# EAGLE schematic akabeacon_circle_ble113 (EAGLE 7.3.2)
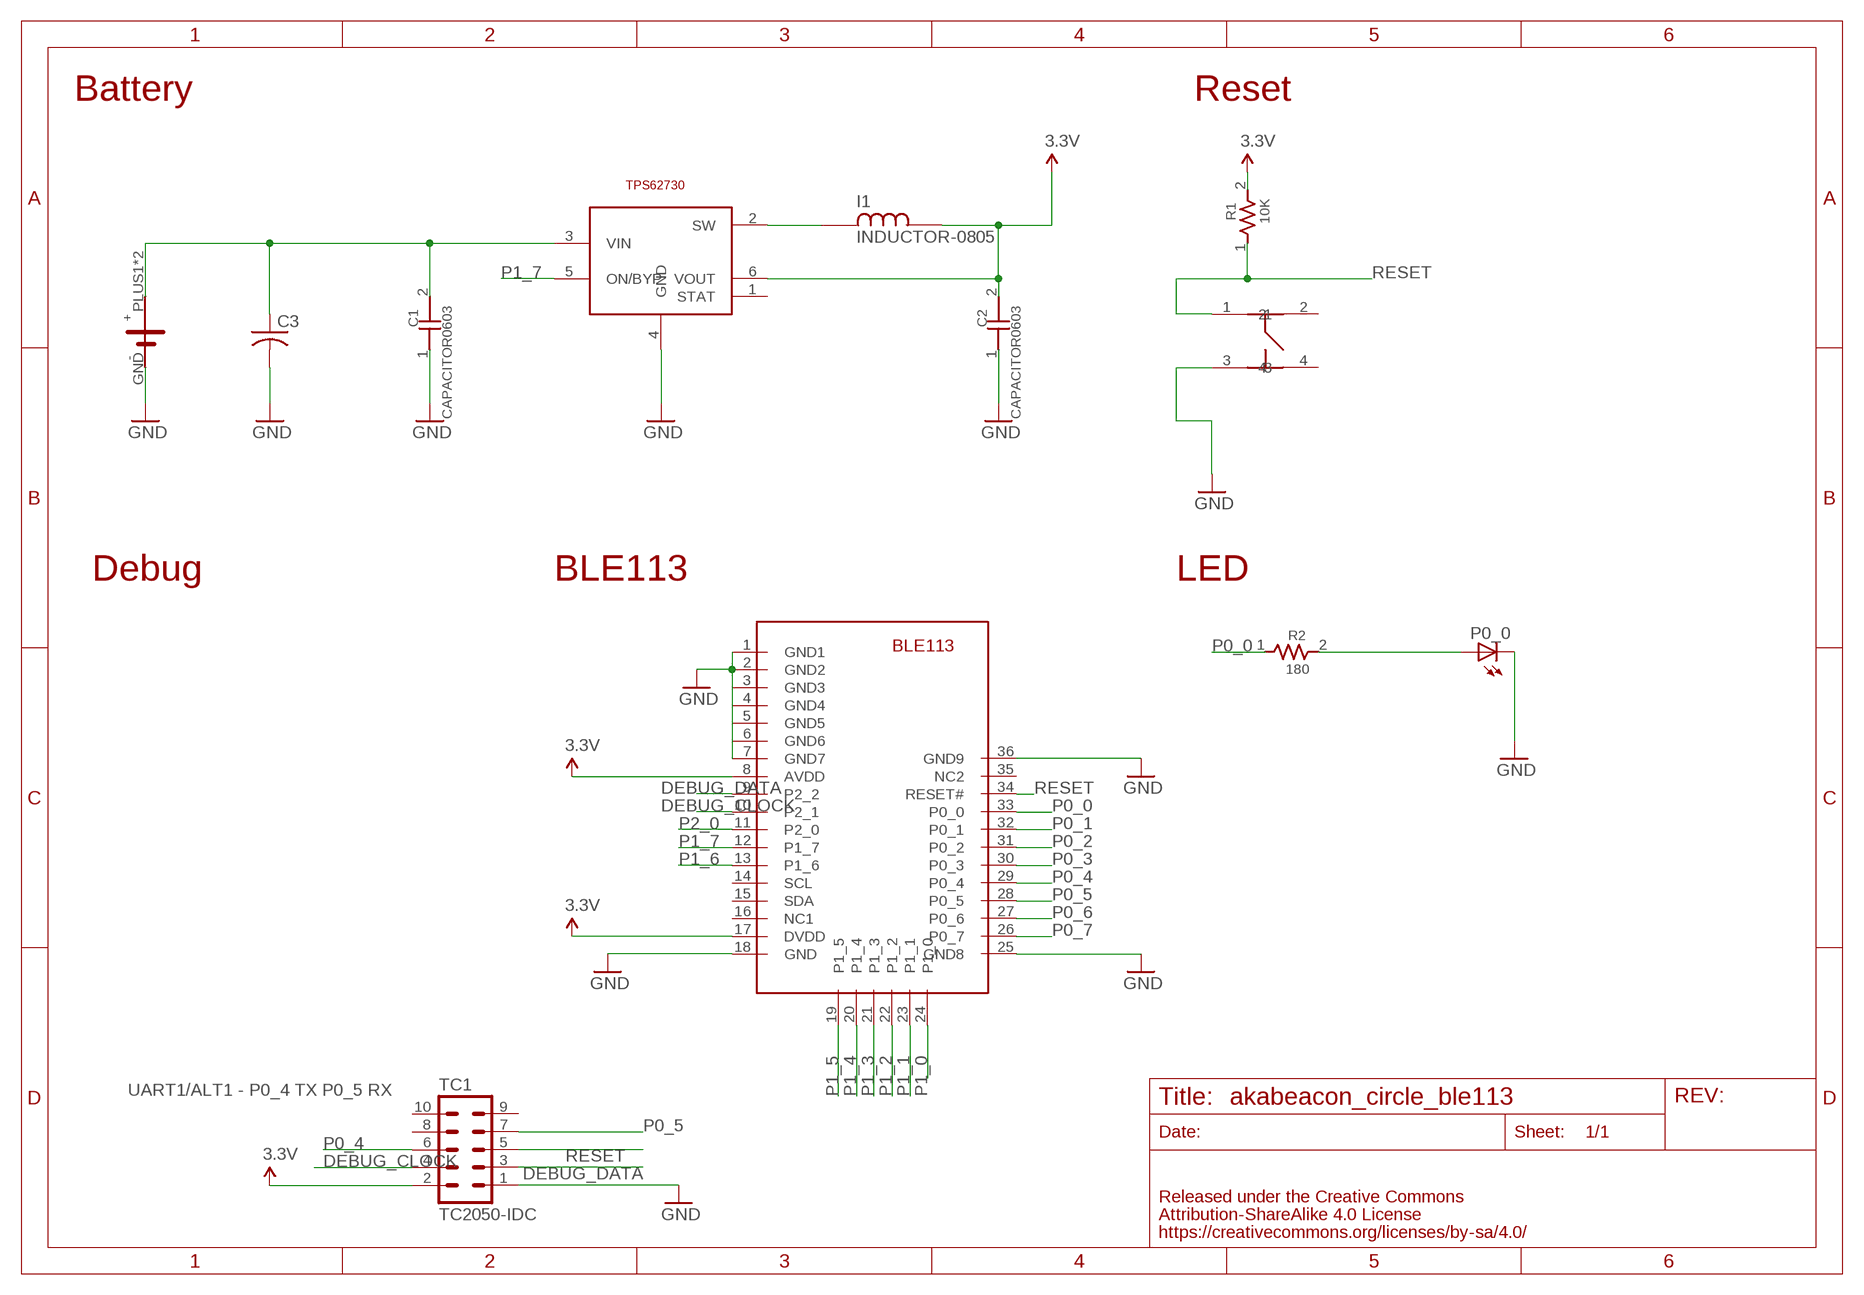
[diagram p0: schematic, sheet 1]

## Parts
C1  CAPACITOR0603  [0603]
C2  CAPACITOR0603  [0603]
C3  C-USC3225  [C3225]
I1  INDUCTOR-0805  [INDUCTOR-0805]
P0_0  LEDCHIP-LED0603  [CHIP-LED0603]
R1  10K  RESISTOR0603  [0603]
R2  180  RESISTOR0603  [0603]
TC1  TC2050-IDC  [TC2050-IDC-NL]
TPS1  TI-TPS62730  [TI-TPS62730]
U$1  CIRCLE-TYPE1  [CIRCLE-TYE1-TC2030]
U$4  BLE113  [BLE113]
U$5  SWICTH-4P(KMR2)  [SWITCH-4P(KMR2)]

## Nets
3.3V: C2.2 I1.P$2 R1.2 TC1.2 TPS1.6(VOUT) U$4.8(AVDD) U$4.17(DVDD)
DEBUG_CLOCK: TC1.4 U$4.10(P2_1)
DEBUG_DATA: TC1.3 U$4.9(P2_2)
GND: C1.1 C2.1 C3.2 P0_0.C TC1.1 TPS1.4(GND) U$1.GND U$4.1(GND1) U$4.2(GND2) U$4.3(GND3) U$4.4(GND4) U$4.5(GND5) U$4.6(GND6) U$4.7(GND7) U$4.18(GND) U$4.25(GND8) U$4.36(GND9) U$5.3
N$1: C1.2 C3.1 TPS1.3(VIN) U$1.PLUS1(VCC) U$1.PLUS2(VCC)
N$5: I1.P$1 TPS1.2(SW)
P0_0: R2.1 U$4.33(P0_0)
P0_1: U$4.32(P0_1)
P0_2: U$4.31(P0_2)
P0_3: U$4.30(P0_3)
P0_4: TC1.6 U$4.29(P0_4)
P0_5: TC1.7 U$4.28(P0_5)
P0_6: U$4.27(P0_6)
P0_7: U$4.26(P0_7)
P1_0: U$4.24(P1_0)
P1_1: U$4.23(P1_1)
P1_2: U$4.22(P1_2)
P1_3: U$4.21(P1_3)
P1_4: U$4.20(P1_4)
P1_5: U$4.19(P1_5)
P1_6: U$4.13(P1_6)
P1_7: TPS1.5(ON/BYP) U$4.12(P1_7)
P2_0: U$4.11(P2_0)
R2: P0_0.A R2.2
RESET: R1.1 TC1.5 U$4.34(RESET#) U$5.1
Unconnected: TC1.8 TC1.9 TC1.10 TPS1.1(STAT) U$4.14(SCL) U$4.15(SDA) U$4.16(NC1) U$4.35(NC2) U$5.2 U$5.4

## Notes on the sheet
- Battery | Reset
- Debug | BLE113 | LED
- UART1/ALT1 - P0_4 TX P0_5 RX

## Library data of the parts
C1 C2 = GClue-Capacitor:CAPACITOR
C3 = rcl:C-US: CAPACITOR, American symbol
I1 = gclueParts:INDUCTOR-0805
P0_0 = led:LED: LED OSRAM: - CHIPLED LG R971, LG N971, LY N971, LG Q971, LY Q971, LO R971, LY R971 LH N974, LH R974 LS Q976, LO Q976, LY Q976 LO Q996 - Hyper CHIPLED LW Q18S LB Q993, LB Q99A, LB R99A - SideLED LS A670, LO A670, LY A670, LG A670, LP A670 LB A673, LV A673, LT A673, LW A673 LH A674 LY A675 LS A676, LA A676, LO A676, LY A676, LW A676 LS A679, LY A679, LG A679 - Hyper Micro SIDELED® LS Y876, LA Y876, LO Y876, LY Y876 LT Y87S - SmartLED LW L88C, LW L88S LB L89C, LB L89S, LG L890 LS L89K, LO L89K, LY L89K LS L896, LA L896, LO L896, LY L896 - TOPLED LS T670, LO T670, LY T670, LG T670, LP T670 LSG T670, LSP T670, LSY T670, LOP T670, LYG T670 LG T671, LOG T671, LSG T671 LB T673, LV T673, LT T673, LW T673 LH T674 LS T676, LA T676, LO T676, LY T676, LB T676, LH T676, LSB T676, LW T676 LB T67C, LV T67C, LT T67C, LS T67K, LO T67K, LY T67K, LW E67C LS E67B, LA E67B, LO E67B, LY E67B, LB E67C, LV E67C, LT E67C LW T67C LS T679, LY T679, LG T679 LS T770, LO T770, LY T770, LG T770, LP T770 LB T773, LV T773, LT T773, LW T773 LH T774 LS E675, LA E675, LY E675, LS T675 LS T776, LA T776, LO T776, LY T776, LB T776 LHGB T686 LT T68C, LB T68C - Hyper Mini TOPLED® LB M676 - Mini TOPLED Santana® LG M470 LS M47K, LO M47K, LY M47K Source: http://www.osram.convergy.de LUXEON: - LUMILED® LXK2-PW12-R00, LXK2-PW12-S00, LXK2-PW14-U00, LXK2-PW14-V00 LXK2-PM12-R00, LXK2-PM12-S00, LXK2-PM14-U00 LXK2-PE12-Q00, LXK2-PE12-R00, LXK2-PE12-S00, LXK2-PE14-T00, LXK2-PE14-U00 LXK2-PB12-K00, LXK2-PB12-L00, LXK2-PB12-M00, LXK2-PB14-N00, LXK2-PB14-P00, LXK2-PB14-Q00 LXK2-PR12-L00, LXK2-PR12-M00, LXK2-PR14-Q00, LXK2-PR14-R00 LXK2-PD12-Q00, LXK2-PD12-R00, LXK2-PD12-S00 LXK2-PH12-R00, LXK2-PH12-S00 LXK2-PL12-P00, LXK2-PL12-Q00, LXK2-PL12-R00 Source: www.luxeon.com KINGBRIGHT: KA-3528ASYC Source: www.kingbright.com
R1 R2 = GClue-Resistors:RESISTOR
TC1 = TagConnect:TC2050-IDC: Tag-Connect In Circuit Programming & Debug Cable 10 Pin http://www.tag-connect.com
TPS1 = gclueSupply:TI-TPS62730
U$1 = GClue-Beacon:CIRCLE-TYPE1
U$4 = gclue:BLE113
U$5 = gclue-test:SWICTH-4P(KMR2)